# Altium schematic sheet aafilter.SCHDOC: 8+2 Acquisition Board
size B; Engineer: Eric Jonas (jonas@mwl.mit.edu); Organization: PILM, MIT; Address1: 46-5227; Address2: 43 Vassar St.; Address3: Cambridge, MA 02139; Address4: Australia 2086; PageSetup: Record=PageOptions|CenterHorizontal=False|CenterVertical=False|PrintScale=1.09|XCorrection=1.00|YCorrection=1.00|PrintKind=1|BorderSize=5000000|LeftOffset=0|BottomOffset=0|Orientation=2|PaperLength=0|PaperWidth=0|Scale=100|PaperSource=259|PrintQuality=600|MediaType=0|DitherType=0|PaperKind=11x17|PrintScaleMode=1
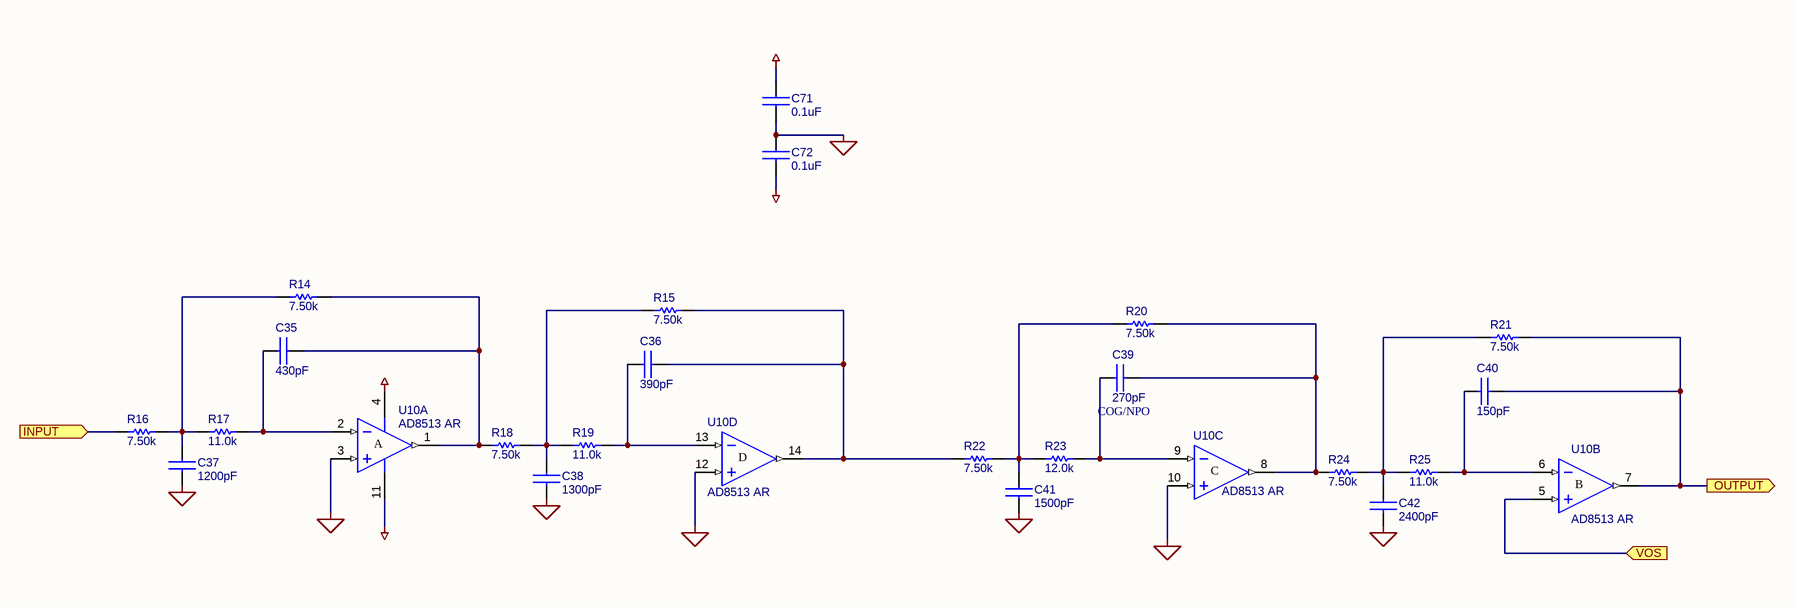
[diagram p0: aafilter.SCHDOC]

## Parts
C35  value 430pF  [0603]  (hidden comment: CAPACITOR)
C36  value 390pF  [0603]  (hidden comment: CAPACITOR)
C37  value 1200pF  [0603]  (hidden comment: CAPACITOR)
C38  value 1300pF  [0603]  (hidden comment: CAPACITOR)
C39  value 270pF  Type: COG/NPO  [0603]  (hidden comment: CAPACITOR)
C40  value 150pF  [0603]  (hidden comment: CAPACITOR)
C41  value 1500pF  [0603]  (hidden comment: CAPACITOR)
C42  value 2400pF  [0603]  (hidden comment: CAPACITOR)
C71  value 0.1uF  [0603]  (hidden comment: CAPACITOR)
C72  value 0.1uF  [0603]  (hidden comment: CAPACITOR)
R14  value 7.50k  [0603]  (hidden comment: RESISTOR)
R15  value 7.50k  [0603]  (hidden comment: RESISTOR)
R16  value 7.50k  [0603]  (hidden comment: RESISTOR)
R17  value 11.0k  [0603]  (hidden comment: RESISTOR)
R18  value 7.50k  [0603]  (hidden comment: RESISTOR)
R19  value 11.0k  [0603]  (hidden comment: RESISTOR)
R20  value 7.50k  [0603]  (hidden comment: RESISTOR)
R21  value 7.50k  [0603]  (hidden comment: RESISTOR)
R22  value 7.50k  [0603]  (hidden comment: RESISTOR)
R23  value 12.0k  [0603]  (hidden comment: RESISTOR)
R24  value 7.50k  [0603]  (hidden comment: RESISTOR)
R25  value 11.0k  [0603]  (hidden comment: RESISTOR)
U10  AD8513 AR  [SO-G14]  (parts A,B,C,D of 4)

## Ports
INPUT (in), OUTPUT (out), VOS (in)

## Nets
AGND: C37.1 C38.1 C41.1 C42.1 C71.1 C72.2 U10.3(IN+A) U10.10(IN+C) U10.12(IN+D)
AVDD: C71.2 U10.4(V+)
AVSS: C72.1 U10.11(V-)
INPUT: R16.1 ; port INPUT
OUTPUT: C40.1 R21.1 U10.7(OUTB) ; port OUTPUT
VOS: U10.5(IN+B) ; port VOS
NetC35_1: C35.1 R14.1 R18.1 U10.1(OUTA)
NetC35_2: C35.2 R17.2 U10.2(IN-A)
NetC36_1: C36.1 R15.1 R22.1 U10.14(OUTD)
NetC36_2: C36.2 R19.2 U10.13(IN-D)
NetC37_2: C37.2 R14.2 R16.2 R17.1
NetC38_2: C38.2 R15.2 R18.2 R19.1
NetC39_1: C39.1 R20.1 R24.1 U10.8(OUTC)
NetC39_2: C39.2 R23.2 U10.9(IN-C)
NetC40_2: C40.2 R25.2 U10.6(IN-B)
NetC41_2: C41.2 R20.2 R22.2 R23.1
NetC42_2: C42.2 R21.2 R24.2 R25.1

## Notes on the sheet
- Title:
- Engineer:
- Date:
- Revision:
- Sheet
- of
- File:
- (in symbol AD8513ARU, part A) A
- (in symbol AD8513ARU, part B) B
- (in symbol AD8513ARU, part C) C
- (in symbol AD8513ARU, part D) D

## Library data of the parts
C35-C38 C40-C42 = CAPACITOR: Standard Capacitor; Type: COG/NPO
C39 C71 C72 = CAPACITOR: Standard Capacitor
R14-R25 = RESISTOR: Standard Passive Resistor; Tolerance: 1%
U10 = AD8513ARU: low-noise JFET quad OA; Vendor: Analog Devices; Part: AD8513AR